# Altium schematic sheet Top.SchDoc
size A
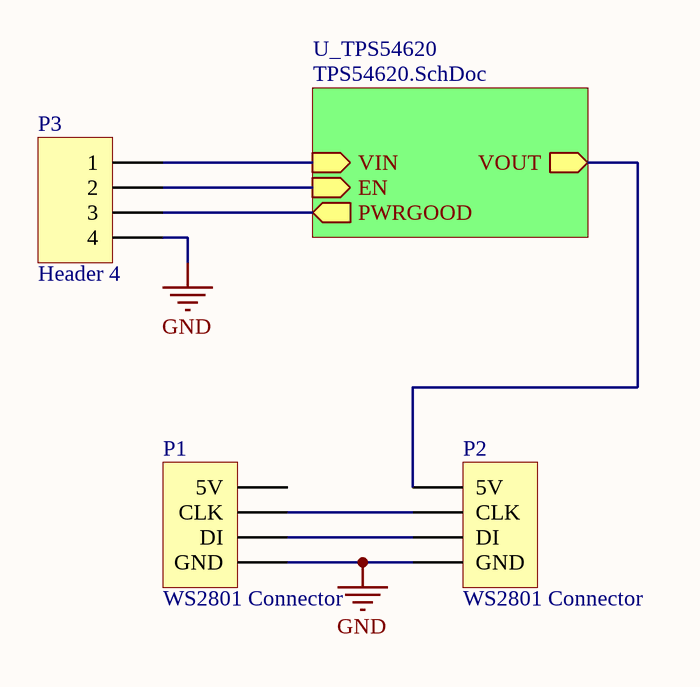
[diagram p0: Top.SchDoc]

## Parts
P1  WS2801 Connector  [HDR1X4]
P2  WS2801 Connector  [HDR1X4]
P3  Header 4  [HDR1X4]

## Sub-sheets
U_TPS54620 = TPS54620.SchDoc: VOUT (out), VIN (in), EN (in), PWRGOOD (out)

## Nets
GND: P1.4(GND) P2.4(GND) P3.4
NetP1_2: P1.2(CLK) P2.2(CLK)
NetP1_3: P1.3(DI) P2.3(DI)
NetP2_1: P2.1(5V) ; sheet U_TPS54620/VOUT
NetP3_1: P3.1 ; sheet U_TPS54620/VIN
NetP3_2: P3.2 ; sheet U_TPS54620/EN
NetP3_3: P3.3 ; sheet U_TPS54620/PWRGOOD

Not connected (* = marked no-connect by the designer): P1 1(5V)

## Library data of the parts
P1 P2 = WS2801 Connector: Header, 4-Pin; LatestRevisionDate: 17-Jul-2002; LatestRevisionNote: Re-released for DXP Platform.; Publisher: Altium Limited
P3 = Header 4: Header, 4-Pin; LatestRevisionDate: 17-Jul-2002; LatestRevisionNote: Re-released for DXP Platform.; Publisher: Altium Limited